# Altium project 降压模块.PrjPcb
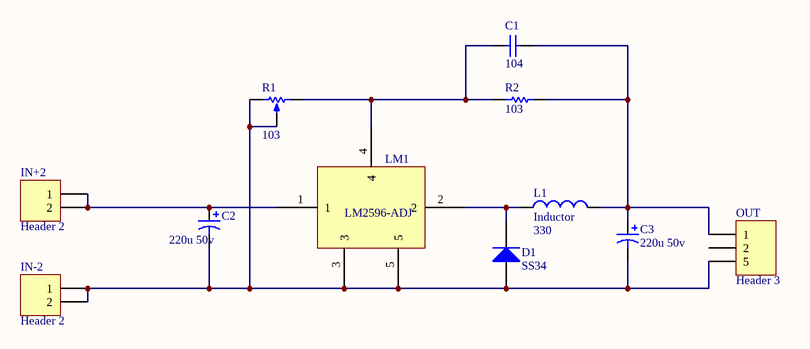
[diagram p0: 降压模块.SchDoc]
2 sheets, 23 parts. Net scope: global (net labels, ports and power ports of the same name join across sheets).
Board file: 降压模块.PcbDoc
Sheets:
  降压模块.SchDoc
  升压模块.SchDoc

## Sheet 降压模块.SchDoc
size A4

### Parts
C1  104  [C1206]
C2  220u 50v  [ABSM-1574]
C3  220u 50v  [ABSM-1574]
D1  SS34  [SMC]
IN+2  Header 2  [HDR2X2]
IN-2  Header 2  [HDR2X2]
L1  Inductor  value 330  [l]
LM1  Component_1  [d2]  (value not drawn)
OUT  Header 3  [HDR1X5]
R1  103  [HDR1X5]
R2  103  [C1206]

### Nets
NetC1_1: C1.1 LM1.4 R1.1(BOT) R2.1
NetC1_2: C1.2 C3.1 L1.0 OUT.1 R2.2
NetC2_1: C2.1 IN+2.1 IN+2.2 LM1.1
NetC2_2: C2.2 C3.2 D1.1(A) IN-2.1 IN-2.2 LM1.3 LM1.5 OUT.5 R1.3(TAP) R1.5(TOP)
NetD1_2: D1.2(K) L1.1 LM1.2

Not connected (* = marked no-connect by the designer): OUT 2

### Notes on the sheet
- (in symbol Component_1) LM2596-ADJ

### Library data of the parts
C1 = Cap: Capacitor; Value: 100pF; Published: 8-Jun-2000; LatestRevisionDate: 17-Jul-2002; LatestRevisionNote: Re-released for DXP Platform.; PackageReference: RAD-0.3; Publisher: Altium Limited
C2 C3 = Cap Pol1: Polarized Capacitor (Radial); Value: 100pF; Published: 8-Jun-2000; LatestRevisionDate: 17-Jul-2002; LatestRevisionNote: Re-released for DXP Platform.; PackageReference: RB7.6-15; Publisher: Altium Limited
D1 = Diode: Default Diode; Published: 8-Jun-2000; LatestRevisionDate: 17-Jul-2002; LatestRevisionNote: Re-released for DXP Platform.; PackageDocument: Sep-1996; PackageReference: SMC; Publisher: Altium Limited; Code_JEDEC: DO-214-AB
IN+2 IN-2 = Header 2: Header, 2-Pin; LatestRevisionDate: 17-Jul-2002; LatestRevisionNote: Re-released for DXP Platform.; Publisher: Altium Limited
L1 = Inductor: Code_IEC: 1005; Published: 8-Jun-2000; LatestRevisionDate: 17-Jul-2002; LatestRevisionNote: Re-released for DXP Platform.; PackageReference: 0402-A; Publisher: Altium Limited; Code_JEITA: 0402
OUT = Header 3: Header, 3-Pin; LatestRevisionDate: 17-Jul-2002; LatestRevisionNote: Re-released for DXP Platform.; Publisher: Altium Limited
R1 = RPot: Potentiometer; Sim Note: Enter the Resistance value and the set point into parameter fields.; Set Position: 0.5; Value: 1K; Published: 8-Jun-2000; LatestRevisionDate: 17-Jul-2002; LatestRevisionNote: Re-released for DXP Platform.; PackageReference: VR5; Publisher: Altium Limited
R2 = Res1: Resistor; Value: 1K; Published: 8-Jun-2000; LatestRevisionDate: 17-Jul-2002; LatestRevisionNote: Re-released for DXP Platform.; PackageReference: AXIAL-0.3; Publisher: Altium Limited

## Sheet 升压模块.SchDoc
size A4
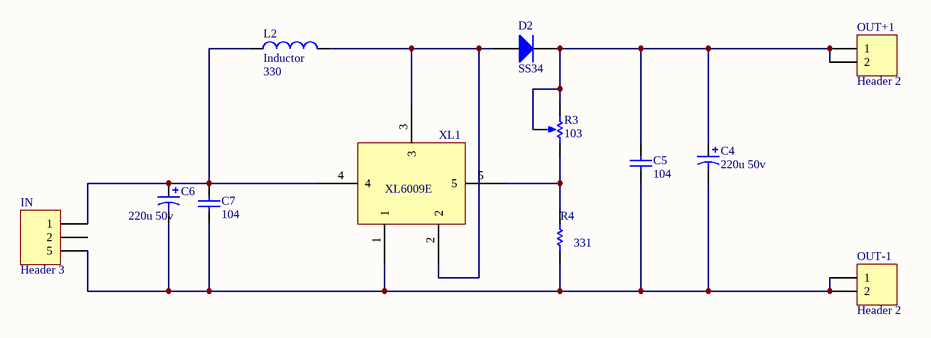
[diagram p1: 升压模块.SchDoc]

### Parts
C4  220u 50v  [ABSM-1574]
C5  104  [C1206]
C6  220u 50v  [ABSM-1574]
C7  104  [C1206]
D2  SS34  [SMC]
IN  Header 3  [HDR1X5]
L2  Inductor  value 330  [l]
OUT+1  Header 2  [HDR2X2]
OUT-1  Header 2  [HDR2X2]
R3  103  [HDR1X3]
R4  331  [C1206]
XL1  XL6009e  [d2]  (value not drawn)

### Nets
NetC4_1: C4.1 C5.2 D2.2(K) OUT+1.1 OUT+1.2 R3.2(TAP) R3.3(TOP)
NetC4_2: C4.2 C5.1 C6.2 C7.1 IN.5 OUT-1.1 OUT-1.2 R4.1 XL1.1
NetC6_1: C6.1 C7.2 IN.1 L2.1 XL1.4
NetD2_1: D2.1(A) L2.0 XL1.2 XL1.3
NetR3_1: R3.1(BOT) R4.2 XL1.5

Not connected (* = marked no-connect by the designer): IN 2

### Notes on the sheet
- (in symbol XL6009e) XL6009E

### Library data of the parts
C4 C6 = Cap Pol1: as C2 on sheet 降压模块; Published: 8-Jun-2000; LatestRevisionDate: 17-Jul-2002; LatestRevisionNote: Re-released for DXP Platform.; PackageReference: RB7.6-15; Publisher: Altium Limited
C5 C7 = Cap: Capacitor; Value: 100pF; Published: 8-Jun-2000; LatestRevisionDate: 17-Jul-2002; LatestRevisionNote: Re-released for DXP Platform.; PackageReference: RAD-0.3; Publisher: Altium Limited
D2 = Diode: Default Diode; Published: 8-Jun-2000; LatestRevisionDate: 17-Jul-2002; LatestRevisionNote: Re-released for DXP Platform.; PackageDocument: Sep-1996; PackageReference: SMC; Publisher: Altium Limited; Code_JEDEC: DO-214-AB
IN = Header 3: Header, 3-Pin; LatestRevisionDate: 17-Jul-2002; LatestRevisionNote: Re-released for DXP Platform.; Publisher: Altium Limited
L2 = Inductor: Code_IEC: 1005; Published: 8-Jun-2000; LatestRevisionDate: 17-Jul-2002; LatestRevisionNote: Re-released for DXP Platform.; PackageReference: 0402-A; Publisher: Altium Limited; Code_JEITA: 0402
OUT+1 OUT-1 = Header 2: Header, 2-Pin; LatestRevisionDate: 17-Jul-2002; LatestRevisionNote: Re-released for DXP Platform.; Publisher: Altium Limited
R3 = RPot: as R1 on sheet 降压模块; Published: 8-Jun-2000; LatestRevisionDate: 17-Jul-2002; LatestRevisionNote: Re-released for DXP Platform.; PackageReference: VR5; Publisher: Altium Limited
R4 = Res1: Resistor; Value: 1K; Published: 8-Jun-2000; LatestRevisionDate: 17-Jul-2002; LatestRevisionNote: Re-released for DXP Platform.; PackageReference: AXIAL-0.3; Publisher: Altium Limited